# EAGLE design OMNIBUS Stepper board v2 (EAGLE 9.3.1)
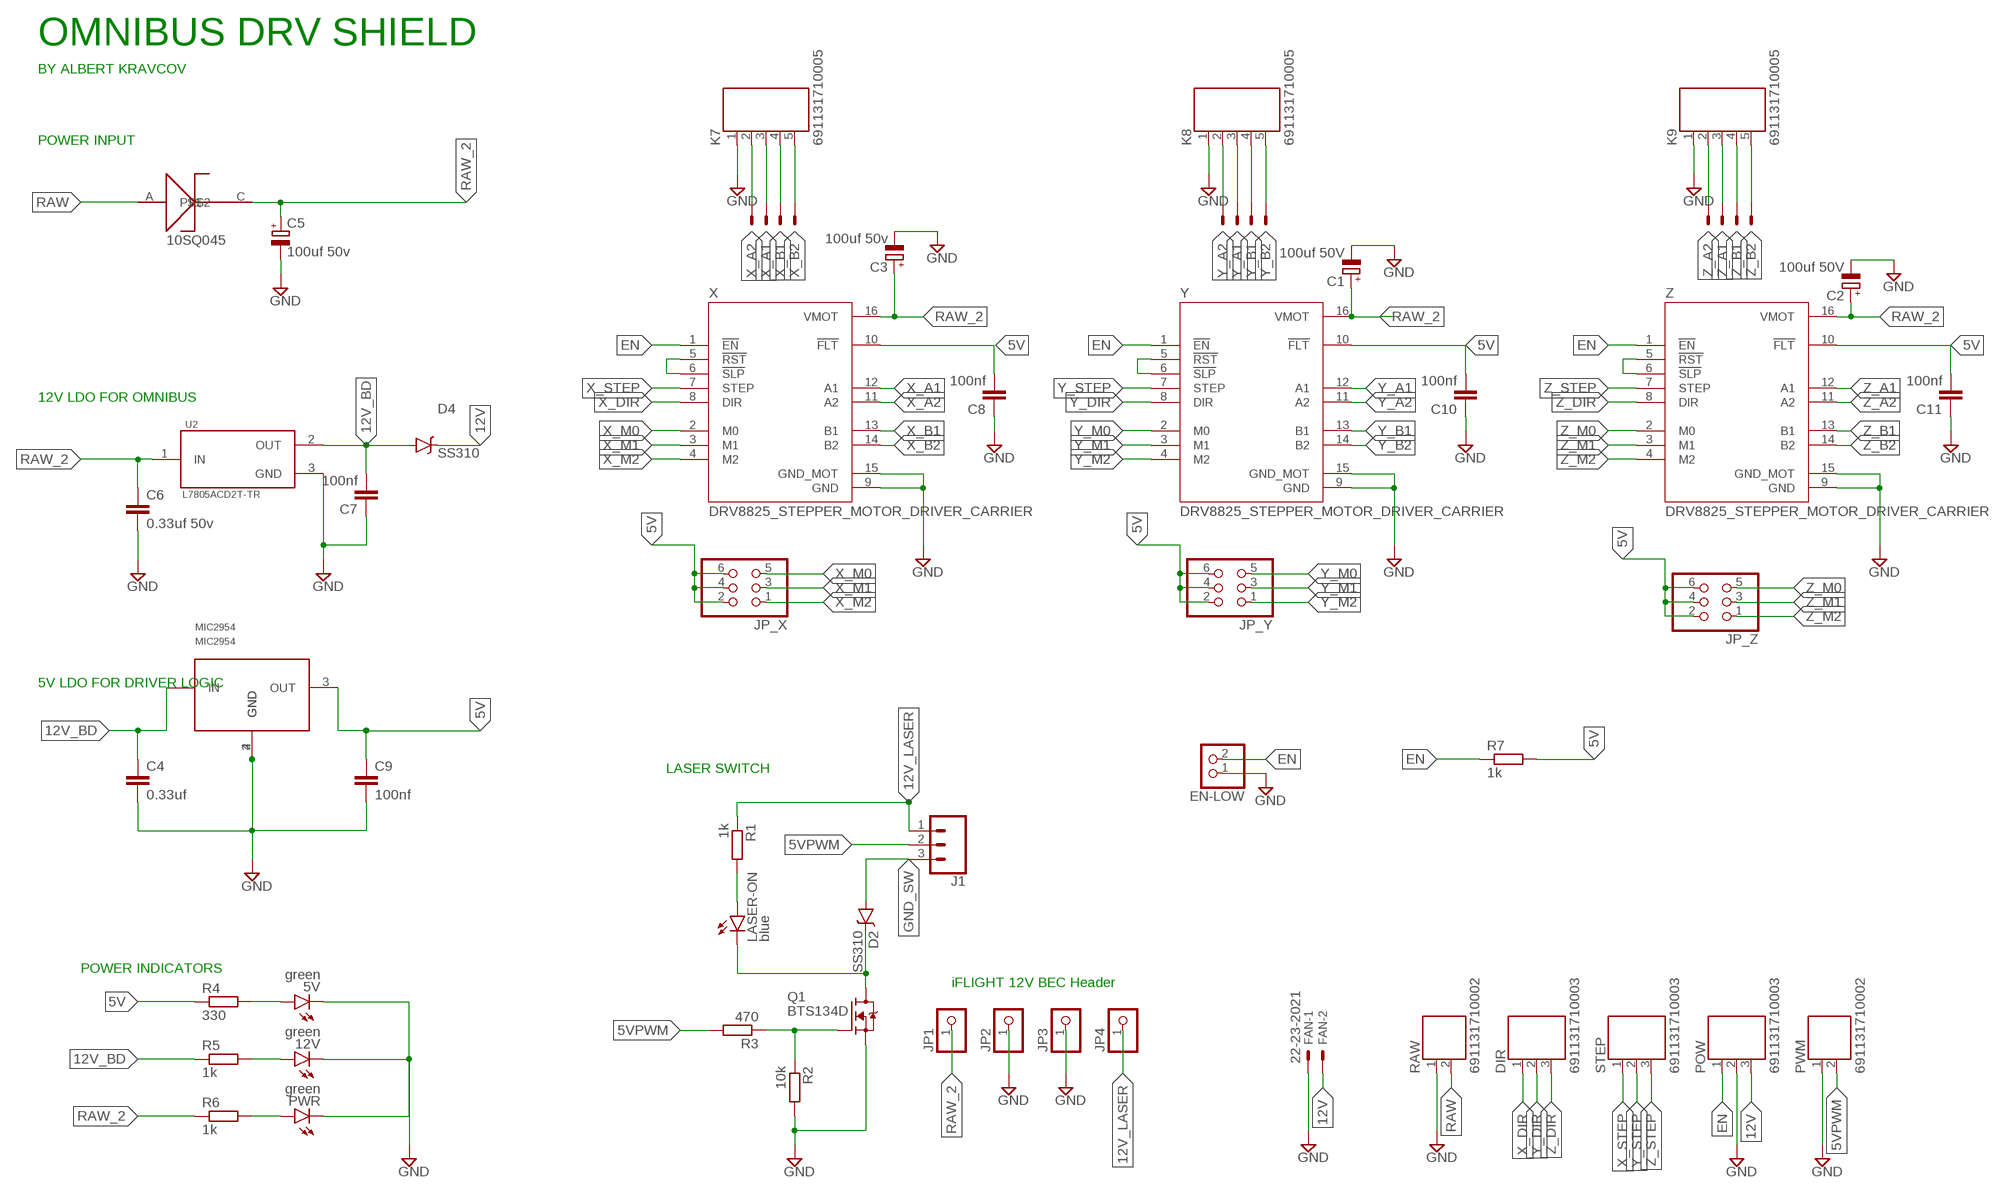
[diagram p0: schematic, sheet 1]

## Parts
5V  green  LEDCHIPLED_0805  [CHIPLED_0805]
12V  green  LEDCHIPLED_0805  [CHIPLED_0805]
C1  100uf 50V  CPOL-EUE5-6  [E5-6]
C2  100uf 50V  CPOL-EUE5-6  [E5-6]
C3  100uf 50v  CPOL-EUE5-6  [E5-6]
C4  0.33uf  C-EUC1206  [C1206]
C5  100uf 50v  CPOL-EUE5-8.5  [E5-8,5]
C6  0.33uf 50v  C-EUC1206  [C1206]
C7  100nf  C-EUC0805  [C0805]
C8  100nf  C-EUC0805  [C0805]
C9  100nf  C-EUC1206  [C1206]
C10  100nf  C-EUC0805  [C0805]
C11  100nf  C-EUC0805  [C0805]
D1  10SQ045  10SQ050  [DIOAD885W125L910D885]
D2  SS310  SS54  [DO-214AC]
D4  SS310  SS54  [DO-214AC]
DIR  691131710003  [691131710003]
EN-LOW  PINHD-1X2  [1X02]
FAN  22-23-2021  [22-23-2021]
J1  CONN_03  [1X03]
JP1  PINHD-1X1  [1X01]
JP2  PINHD-1X1  [1X01]
JP3  PINHD-1X1  [1X01]
JP4  PINHD-1X1  [1X01]
JP_X  PINHD-2X3  [2X03]
JP_Y  PINHD-2X3  [2X03]
JP_Z  PINHD-2X3  [2X03]
K7  691131710005  [691131710005]
K8  691131710005  [691131710005]
K9  691131710005  [691131710005]
LASER-ON  blue  LEDCHIPLED_0805  [CHIPLED_0805]
MIC2954  MIC2954  [SOT223]
POW  691131710003  [691131710003]
PWM  691131710002  [691131710002]
PWR  green  LEDCHIPLED_0805  [CHIPLED_0805]
Q1  BTS134D  FQD7N10LTM  [TO-252]
R1  1k  R-EU_R0805  [R0805]
R2  10k  R-EU_R0805  [R0805]
R3  470  R-EU_R0805  [R0805]
R4  330  R-EU_R0805  [R0805]
R5  1k  R-EU_R0805  [R0805]
R6  1k  R-EU_R1206  [R1206]
R7  1k  R-EU_R0805  [R0805]
RAW  691131710002  [691131710002]
STEP  691131710003  [691131710003]
U2  L7805ACD2T-TR  [TO254P1515X470-3N]
X  DRV8825_STEPPER_MOTOR_DRIVER_CARRIER  [IC_DRV8825_STEPPER_MOTOR_DRIVER_CARRIER]
X_MOTOR  22-23-2041  [22-23-2041]
Y  DRV8825_STEPPER_MOTOR_DRIVER_CARRIER  [IC_DRV8825_STEPPER_MOTOR_DRIVER_CARRIER]
Y_MOTOR  22-23-2041  [22-23-2041]
Z  DRV8825_STEPPER_MOTOR_DRIVER_CARRIER  [IC_DRV8825_STEPPER_MOTOR_DRIVER_CARRIER]
Z_MOTOR  22-23-2041  [22-23-2041]

## Nets
5V [power]: C8.2 C9.1 C10.2 C11.2 JP_X.2 JP_X.4 JP_X.6 JP_Y.2 JP_Y.4 JP_Y.6 JP_Z.2 JP_Z.4 JP_Z.6 MIC2954.3(OUT) R4.1 R7.2 X.10(!FLT) Y.10(!FLT) Z.10(!FLT)
5VPWM [power]: J1.2 PWM.2 R3.2
12V [ha]: D4.C FAN.2 POW.3
12V_BD [ha]: C4.1 C7.2 D4.A MIC2954.1(IN) R5.1 U2.2(OUT)
12V_LASER [ha]: J1.1 JP4.1 R1.1
EN: EN-LOW.2 POW.1 R7.1 X.1(!EN) Y.1(!EN) Z.1(!EN)
GND: 5V.C 12V.C C1.- C2.- C3.- C4.2 C5.- C6.2 C7.1 C8.1 C9.2 C10.1 C11.1 EN-LOW.1 FAN.1 JP2.1 JP3.1 K7.1 K8.1 K9.1 MIC2954.2(GND) MIC2954.4(GND) POW.2 PWM.1 PWR.C Q1.3(S) R2.2 RAW.1 U2.3(GND) X.9(GND) X.15(GND_MOT) Y.9(GND) Y.15(GND_MOT) Z.9(GND) Z.15(GND_MOT)
GND_SW [power]: D2.A J1.3
L_SW [power]: D2.C LASER-ON.C Q1.T(D)
N$1: Q1.1(G) R2.1 R3.1
N$2: 5V.A R4.2
N$3: LASER-ON.A R1.2
N$7: 12V.A R5.2
N$10: PWR.A R6.2
NC [power]: Z.5(!RST) Z.6(!SLP)
NC2 [power]: Y.5(!RST) Y.6(!SLP)
NC3 [power]: X.5(!RST) X.6(!SLP)
RAW [ha]: D1.A RAW.2
RAW_2 [ha]: C1.+ C2.+ C3.+ C5.+ C6.1 D1.C JP1.1 R6.1 U2.1(IN) X.16(VMOT) Y.16(VMOT) Z.16(VMOT)
X_A1 [ha]: K7.3 X.12(A1) X_MOTOR.3
X_A2 [ha]: K7.2 X.11(A2) X_MOTOR.4
X_B1 [ha]: K7.4 X.13(B1) X_MOTOR.2
X_B2 [ha]: K7.5 X.14(B2) X_MOTOR.1
X_DIR [power]: DIR.1 X.8(DIR)
X_M0: JP_X.5 X.2(M0)
X_M1: JP_X.3 X.3(M1)
X_M2: JP_X.1 X.4(M2)
X_STEP [power]: STEP.1 X.7(STEP)
Y_A1 [ha]: K8.3 Y.12(A1) Y_MOTOR.3
Y_A2 [ha]: K8.2 Y.11(A2) Y_MOTOR.4
Y_B1 [ha]: K8.4 Y.13(B1) Y_MOTOR.2
Y_B2 [ha]: K8.5 Y.14(B2) Y_MOTOR.1
Y_DIR [power]: DIR.2 Y.8(DIR)
Y_M0: JP_Y.5 Y.2(M0)
Y_M1: JP_Y.3 Y.3(M1)
Y_M2: JP_Y.1 Y.4(M2)
Y_STEP [power]: STEP.2 Y.7(STEP)
Z_A1 [ha]: K9.3 Z.12(A1) Z_MOTOR.3
Z_A2 [ha]: K9.2 Z.11(A2) Z_MOTOR.4
Z_B1 [ha]: K9.4 Z.13(B1) Z_MOTOR.2
Z_B2 [ha]: K9.5 Z.14(B2) Z_MOTOR.1
Z_DIR [power]: DIR.3 Z.8(DIR)
Z_M0: JP_Z.5 Z.2(M0)
Z_M1: JP_Z.3 Z.3(M1)
Z_M2: JP_Z.1 Z.4(M2)
Z_STEP [power]: STEP.3 Z.7(STEP)

## Notes on the sheet
- OMNIBUS DRV SHIELD
- BY ALBERT KRAVCOV
- POWER INPUT
- 10SQ045
- 12V LDO FOR OMNIBUS
- 5V LDO FOR DRIVER LOGIC
- LASER SWITCH
- POWER INDICATORS
- iFLIGHT 12V BEC Header

## Library data of the parts
5V 12V LASER-ON PWR = led:LED: LED OSRAM: - CHIPLED LG R971, LG N971, LY N971, LG Q971, LY Q971, LO R971, LY R971 LH N974, LH R974 LS Q976, LO Q976, LY Q976 LO Q996 - Hyper CHIPLED LW Q18S LB Q993, LB Q99A, LB R99A - SideLED LS A670, LO A670, LY A670, LG A670, LP A670 LB A673, LV A673, LT A673, LW A673 LH A674 LY A675 LS A676, LA A676, LO A676, LY A676, LW A676 LS A679, LY A679, LG A679 - Hyper Micro SIDELED® LS Y876, LA Y876, LO Y876, LY Y876 LT Y87S - SmartLED LW L88C, LW L88S LB L89C, LB L89S, LG L890 LS L89K, LO L89K, LY L89K LS L896, LA L896, LO L896, LY L896 - TOPLED LS T670, LO T670, LY T670, LG T670, LP T670 LSG T670, LSP T670, LSY T670, LOP T670, LYG T670 LG T671, LOG T671, LSG T671 LB T673, LV T673, LT T673, LW T673 LH T674 LS T676, LA T676, LO T676, LY T676, LB T676, LH T676, LSB T676, LW T676 LB T67C, LV T67C, LT T67C, LS T67K, LO T67K, LY T67K, LW E67C LS E67B, LA E67B, LO E67B, LY E67B, LB E67C, LV E67C, LT E67C LW T67C LS T679, LY T679, LG T679 LS T770, LO T770, LY T770, LG T770, LP T770 LB T773, LV T773, LT T773, LW T773 LH T774 LS E675, LA E675, LY E675, LS T675 LS T776, LA T776, LO T776, LY T776, LB T776 LHGB T686 LT T68C, LB T68C - Hyper Mini TOPLED® LB M676 - Mini TOPLED Santana® LG M470 LS M47K, LO M47K, LY M47K Source: http://www.osram.convergy.de LUXEON: - LUMILED® LXK2-PW12-R00, LXK2-PW12-S00, LXK2-PW14-U00, LXK2-PW14-V00 LXK2-PM12-R00, LXK2-PM12-S00, LXK2-PM14-U00 LXK2-PE12-Q00, LXK2-PE12-R00, LXK2-PE12-S00, LXK2-PE14-T00, LXK2-PE14-U00 LXK2-PB12-K00, LXK2-PB12-L00, LXK2-PB12-M00, LXK2-PB14-N00, LXK2-PB14-P00, LXK2-PB14-Q00 LXK2-PR12-L00, LXK2-PR12-M00, LXK2-PR14-Q00, LXK2-PR14-R00 LXK2-PD12-Q00, LXK2-PD12-R00, LXK2-PD12-S00 LXK2-PH12-R00, LXK2-PH12-S00 LXK2-PL12-P00, LXK2-PL12-Q00, LXK2-PL12-R00 Source: www.luxeon.com KINGBRIGHT: KA-3528ASYC Source: www.kingbright.com
C1-C3 C5 = rcl:CPOL-EU: POLARIZED CAPACITOR, European symbol; SPICEPREFIX: C
C4 C6-C11 = rcl:C-EU: CAPACITOR, European symbol; SPICEPREFIX: C
D1 = DIOAD885W125L910D885:10SQ050
D2 D4 = SS54:SS54: SCHOTTKY DIODES 40Vpeak, 28Vrms 5A (SBD) SMA(DO-214AC); AVAILABILITY: Unavailable; DESCRIPTION: Digital Switch Unipolar Switch Open Collector Hall Effect SOT-89B; MF: Honeywell Sensing; MP: SS54; PACKAGE: TO-243AA-243 Honeywell Sensing; PRICE: None
DIR POW STEP = Wurth_Terminal_Blocks_Connectors_rev15d:691131710003: WR-TBL Terminal block - CUU5/3 - 3 Pins;=>Code : Con_TBL_Screw_PClamp_5.00_6911317100xx_691131710003 <http://katalog.we-online.de/media/images/eican/Con_TBL_Screw_PClamp_5.00_6911317100xx_pf2.jpg> Details see: http://katalog.we-online.de/em/datasheet/6911317100xx.pdf Created 11/3/2014, Karrer Zheng 2014 (C) Wurth Elektronik
EN-LOW = pinhead:PINHD-1X2: PIN HEADER
FAN = con-molex:22-23-2021: .100" (2.54mm) Center Header - 2 Pin; MF: MOLEX; MPN: 22-23-2021; OC_FARNELL: 1462926; OC_NEWARK: 25C3832
J1 = SparkFun-Connectors:CONN_03: Multi connection point. Often used as Generic Header-pin footprint for 0.1 inch spaced/style header connections On any of the 0.1 inch spaced packages, you can populate with these: Break Away Headers - Straight <https://www.sparkfun.com/products/116> (PRT-00116) Break Away Male Headers - Right Angle <https://www.sparkfun.com/products/553> (PRT-00553) Female Headers <https://www.sparkfun.com/products/115> (PRT-00115) Break Away Headers - Machine Pin <https://www.sparkfun.com/products/117> (PRT-00117) Break Away Female Headers - Swiss Machine Pin <https://www.sparkfun.com/products/743> (PRT-00743) Stackable Header - 3 Pin (Female, 0.1") <https://www.sparkfun.com/products/13875> (PRT-13875) For SCREWTERMINALS and SPRING TERMINALS visit here: Screw Terimnals on SparkFun.com <https://www.sparkfun.com/search/results?term=Screw+Terminals> (5mm/3.5mm/2.54mm spacing) This device is also useful as a general connection point to wire up your design to another part of your project. Our various solder wires solder well into these plated through hole pads. Hook-Up Wire - Assortment (Stranded, 22 AWG) <https://www.sparkfun.com/products/11375> (PRT-11375) Hook-Up Wire - Assortment (Solid Core, 22 AWG) <https://www.sparkfun.com/products/11367> (PRT-11367) View the entire wire category on our website here <https://www.sparkfun.com/categories/141> Special notes: Molex polarized connector foot print use with SKU : PRT-08232 with associated crimp pins and housings.
JP1-JP4 = pinhead:PINHD-1X1: PIN HEADER
JP_X JP_Y JP_Z = pinhead:PINHD-2X3: PIN HEADER
K7-K9 = Wurth_Terminal_Blocks_Connectors_rev15d:691131710005: WR-TBL Terminal block - CUU5/5 - 5 Pins;=>Code : Con_TBL_Screw_PClamp_5.00_6911317100xx_691131710005 <http://katalog.we-online.de/media/images/eican/Con_TBL_Screw_PClamp_5.00_6911317100xx_pf2.jpg> Details see: http://katalog.we-online.de/em/datasheet/6911317100xx.pdf Created 11/3/2014, Karrer Zheng 2014 (C) Wurth Elektronik
MIC2954 = MIC2954:MIC2954: 5V 250mA regulator; AVAILABILITY: Unavailable; DESCRIPTION: Linear Voltage Regulator IC 1 Output 250mA 8-SOIC; MF: Micrel; MP: MIC2954; PACKAGE: SOT-223-3 Microchip; PRICE: None
PWM RAW = Wurth_Terminal_Blocks_Connectors_rev15d:691131710002: WR-TBL Terminal block - CUU5/2 CUU5/2GR - 2 Pins;=>Code : Con_TBL_Screw_PClamp_5.00_6911317100xx_691131710002 <http://katalog.we-online.de/media/images/eican/Con_TBL_Screw_PClamp_5.00_6911317100xx_pf2.jpg> Details see: http://katalog.we-online.de/em/datasheet/6911317100xx.pdf Created 11/23/2014, Karrer Zheng 2014 (C) Wurth Elektronik
Q1 = FQD7N10LTM:FQD7N10LTM: MOSFET N-CH 100V 5.8A 350mOhm 6nC DPAK Check prices <https://pricing.snapeda.com/parts/FQD7N10LTM/ON%20Semiconductor/view-part?ref=eda>; AVAILABILITY: Good; DESCRIPTION: N-Channel 100V 5.8A (Tc) 2.5W (Ta), 25W (Tc) Surface Mount D-Pak; MF: ON Semiconductor; MP: FQD7N10LTM; PACKAGE: TO-252-3 ON Semiconductor; PRICE: None; PURCHASE-URL: https://pricing.snapeda.com/search/part/FQD7N10LTM/?ref=eda
R1-R7 = rcl:R-EU_: RESISTOR, European symbol; SPICEPREFIX: R
U2 = L7805ACD2T-TR:L7805ACD2T-TR: Positive voltage regulator ICs Check prices <https://pricing.snapeda.com/parts/L7805ACD2T-TR/STMicroelectronics/view-part?ref=eda>; AVAILABILITY: Good; DESCRIPTION: Linear Voltage Regulator IC Positive Fixed 1 Output 1.5A D2PAK; MF: STMicroelectronics; MP: L7805ACD2T-TR; PACKAGE: D2PAK STMicroelectronics; PRICE: None; PURCHASE-URL: https://pricing.snapeda.com/search/part/L7805ACD2T-TR/?ref=eda
X Y Z = DRV8825_STEPPER_MOTOR_DRIVER_CARRIER:DRV8825_STEPPER_MOTOR_DRIVER_CARRIER: Stepper motor controler; IC: DRV8825; 1.5A; Uin mot: 8.2÷45V; AVAILABILITY: Unavailable; DESCRIPTION: Stepper, Bipolar 8.2 ~ 45VDC Supply 1.5A 8.2 ~ 45V Load; MF: Pololu; MP: DRV8825 STEPPER MOTOR DRIVER CARRIER; PACKAGE: None; PRICE: None
X_MOTOR Y_MOTOR Z_MOTOR = con-molex:22-23-2041: .100" (2.54mm) Center Header - 4 Pin; MF: MOLEX; MPN: 22-23-2041; OC_FARNELL: 1462920; OC_NEWARK: 38C0355

## Net classes
0 default: width 0.305 mm, drill 0.305 mm, clearance 0.305 mm
1 power: width 0.635 mm, drill 0.635 mm, clearance 0.635 mm
2 ha: width 1.524 mm, drill 0.762 mm, clearance 1.27 mm

## Board
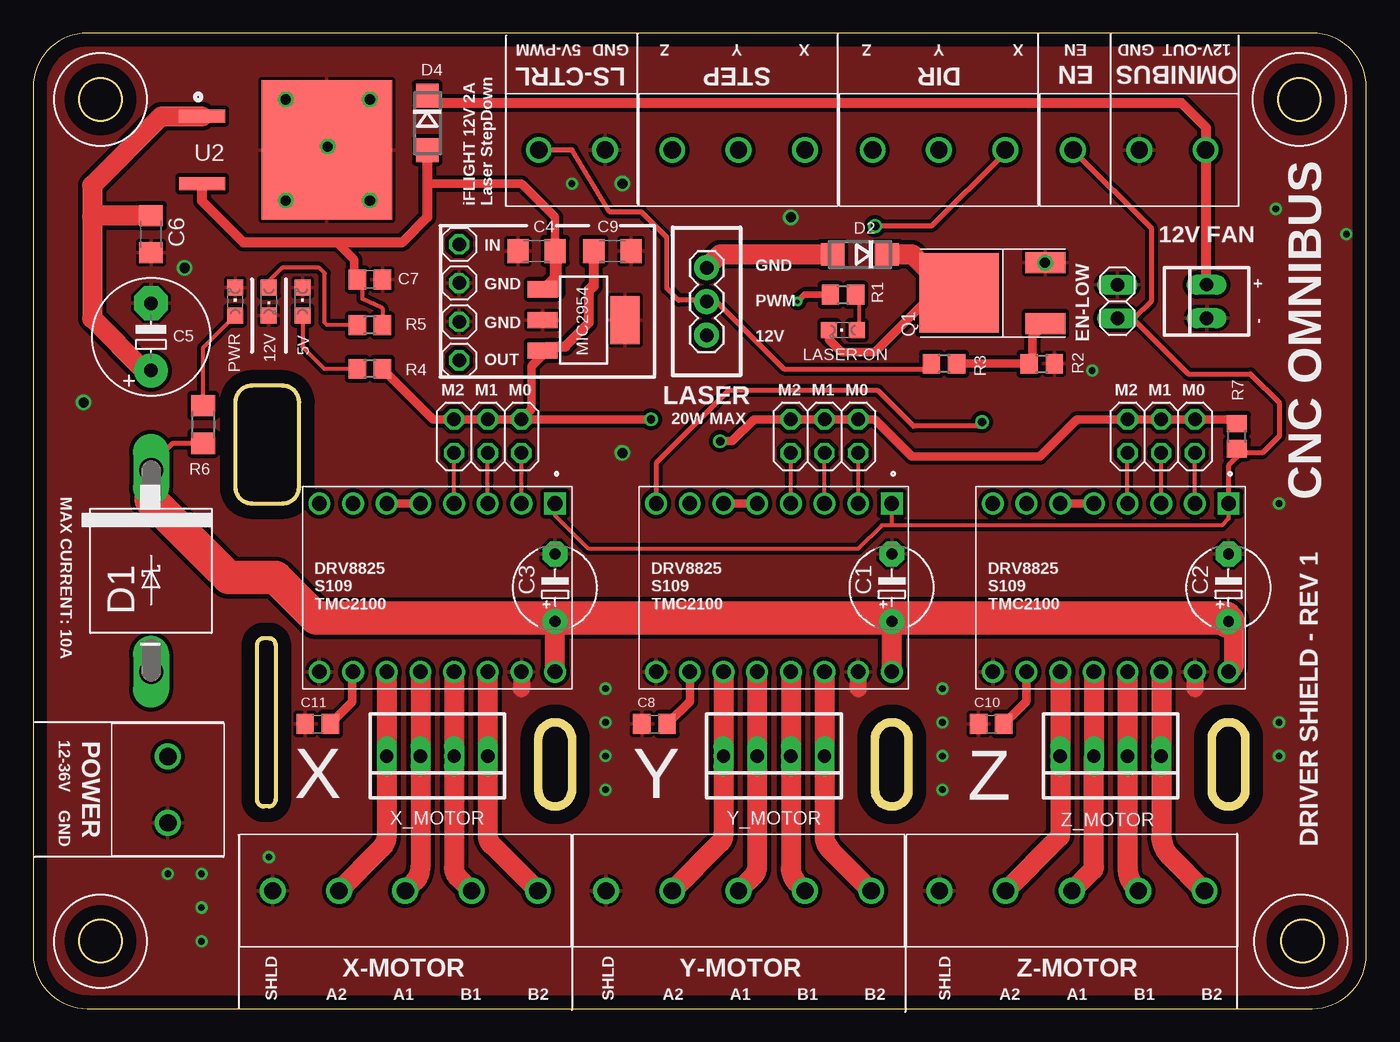
[diagram p1: board, top side]
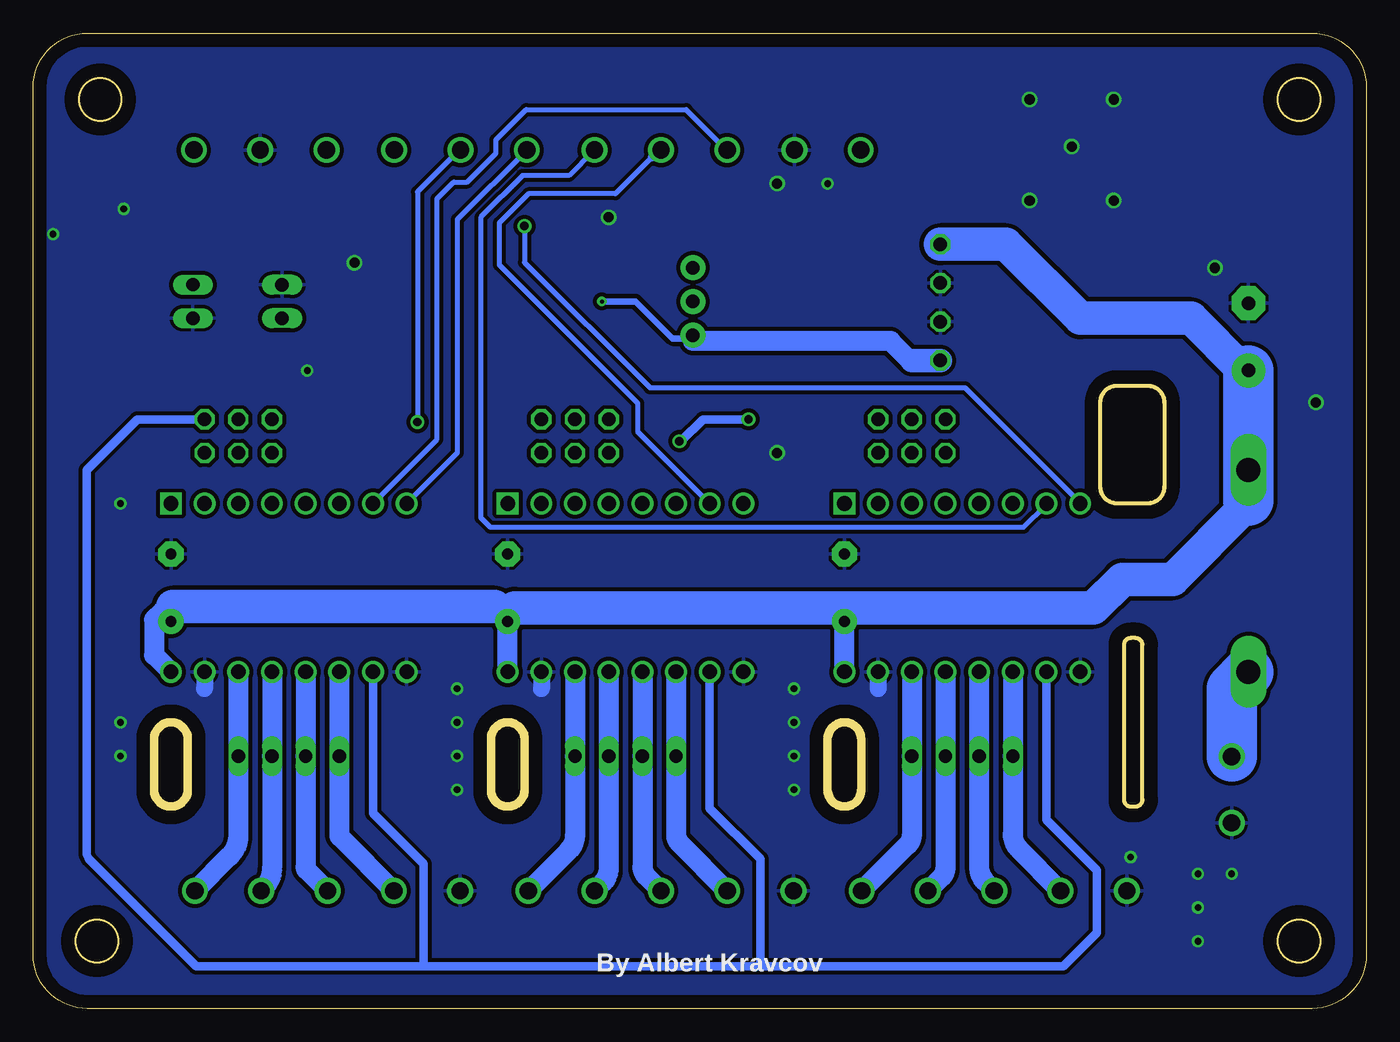
[diagram p2: board, bottom side, seen from below]

Size 100.56 x 73.58 mm. Coordinates in mm from the lower left corner, seen from the top.
Outline: 0,69.52 0,4.06 arc90 4.06,0 96.5,0 arc90 100.56,4.06 100.56,69.52 arc90 96.5,73.58 4.06,73.58 arc90 0,69.52
Outline: 15.24,45.72 15.24,39.37 arc90 16.51,38.1 18.8,38.1 arc90 20.07,39.37 20.07,45.72 arc90 18.8,46.99 16.51,46.99 arc90 15.24,45.72
Outline: 39.37,15.24 arc-90 38.1,16.51 38.1,20.32 arc-90 39.37,21.59 arc-90 40.64,20.32 40.64,16.51 arc-90 39.37,15.24
Outline: 64.77,15.24 arc-90 63.5,16.51 63.5,20.32 arc-90 64.77,21.59 arc-90 66.04,20.32 66.04,16.51 arc-90 64.77,15.24
Outline: 88.9,16.51 88.9,20.32 arc-90 90.17,21.59 arc-90 91.44,20.32 91.44,16.51 arc-90 90.17,15.24 arc-90 88.9,16.51
Outline: 17.78,15.24 17.4,15.24 arc-90 16.89,15.75 16.89,27.43 arc-90 17.4,27.94 17.78,27.94 arc-90 18.29,27.43 18.29,15.75 arc-90 17.78,15.24
Outline: circle at 5.08,5.08 radius 1.6
Outline: circle at 95.76,5.08 radius 1.6
Outline: circle at 5.08,68.58 radius 1.6
Outline: circle at 95.5,68.58 radius 1.6
Copper layers (1*16): Top 0.035mm / dielectric 1.5mm / Bottom 0.035mm
Design rules "default *": minimum track width 6mil, minimum drill 0.35mm, track to track 6mil, track to pad 6mil, pad to pad 6mil, via to via 6mil, smd to smd 6mil, copper to edge 40mil, drill to drill 6mil, minimum pad ring 10mil, minimum via ring 8mil, stop-mask expansion 4mil, vias tented up to drill 2mm, thermal gap 10mil

### Footprints (pad centres in the part's own frame; a part is rotated, then mirrored left to right if it is on the bottom)
CHIPLED_0805 = smd 1.2 x 1.2: A 0,-1.05; C 0,1.05
E5-6 = drill 0.813 pad 1.905: + -2.54,0 | drill 0.813 pad 1.905 octagon: - 2.54,0
C1206 = smd 1.6 x 1.8: 1 -1.4,0; 2 1.4,0
E5-8,5 = drill 1.016 pad 2.54: + -2.54,0 | drill 1.016 pad 2.54 octagon: - 2.54,0
C0805 = smd 1.3 x 1.5: 1 -0.95,0; 2 0.95,0
DIOAD885W125L910D885 = drill 1.803 long: A 7.62,0; C -7.62,0
DO-214AC = smd 1.8 x 1.7: A 2.05,0; C -2.05,0
691131710003 = drill 1.3: 1 -5,0; 2 0,0; 3 5,0
1X02 = drill 1.016 long: 1 -1.27,0; 2 1.27,0
22-23-2021 = drill 1 long: 1 -1.27,0; 2 1.27,0
1X03 = drill 1.016 pad 1.88: 1 0,0; 2 2.54,0; 3 5.08,0
1X01 = drill 1.016 octagon: 1 0,0
2X03 = drill 1.016 octagon: 1 -2.54,-1.27; 2 -2.54,1.27; 3 0,-1.27; 4 0,1.27; 5 2.54,-1.27; 6 2.54,1.27
691131710005 = drill 1.3: 1 -10,0; 2 -5,0; 3 0,0; 4 5,0; 5 10,0
SOT223 = smd 1.219 x 2.235: 1 -2.311,-3.099; 2 0,-3.099; 3 2.311,-3.099 | smd 3.6 x 2.2: 4 0,3.099
691131710002 = drill 1.3: 1 -2.5,0; 2 2.5,0
TO-252 = smd 1.6 x 3: 1 -2.3,-6.5; 3 2.3,-6.5 | smd 6 x 6: T 0,0
R0805 = smd 1.3 x 1.5: 1 -0.95,0; 2 0.95,0
R1206 = smd 1.6 x 1.803: 1 -1.422,0; 2 1.422,0
TO254P1515X470-3N = smd 3.45 x 1: 1 -6.3,2.54; 2 -6.3,-2.54 | smd 9.85 x 10.5: 3 3.1,0
IC_DRV8825_STEPPER_MOTOR_DRIVER_CARRIER = drill 1.1 square: 1 -6.35,8.89 | drill 1.1: 2 -6.35,6.35; 3 -6.35,3.81; 4 -6.35,1.27; 5 -6.35,-1.27; 6 -6.35,-3.81; 7 -6.35,-6.35; 8 -6.35,-8.89; 9 6.35,-8.89; 10 6.35,-6.35; 11 6.35,-3.81; 12 6.35,-1.27; 13 6.35,1.27; 14 6.35,3.81; 15 6.35,6.35; 16 6.35,8.89
22-23-2041 = drill 1 long: 1 -3.81,0; 2 -1.27,0; 3 1.27,0; 4 3.81,0

### Placement (x,y rotation side)
5V  20.32,53.34 0 top
12V  17.78,53.34 180 top
C1  64.77,31.75 90 top
C2  90.17,31.75 90 top
C3  39.37,31.75 90 top
C4  37.97,57.15 180 top
C5  8.89,50.67 90 top
C6  8.89,58.42 270 top
C7  25.4,54.99 180 top
C8  46.86,21.46 0 top
C9  43.69,57.15 0 top
C10  72.26,21.46 0 top
C11  21.46,21.46 0 top
D1  8.89,33.02 270 top
D2  62.36,56.9 180 top
D4  29.72,66.8 270 top
DIR  68.33,64.77 180 top
EN-LOW  81.79,53.34 270 top
FAN  88.52,53.34 90 top
J1  50.8,50.8 90 top
JP1  32.13,57.66 0 top
JP2  32.13,54.74 0 top
JP3  32.13,51.82 0 top
JP4  32.13,48.9 0 top
JP_X  34.29,43.18 0 top
JP_Y  59.69,43.18 0 top
JP_Z  85.09,43.18 0 top
K7  28.07,8.89 0 top
K8  53.21,8.89 0 top
K9  78.36,8.89 0 top
LASER-ON  61.09,51.18 90 top
MIC2954  41.53,51.94 270 top
POW  83.44,64.77 0 top
PWM  40.64,64.77 180 top
PWR  15.24,53.34 0 top
Q1  69.85,53.98 90 top
R1  61.09,53.85 0 top
R2  76.07,48.64 0 top
R3  68.71,48.64 180 top
R4  25.4,48.26 180 top
R5  25.4,51.56 180 top
R6  12.83,44.07 90 top
R7  90.81,43.18 90 top
RAW  10.16,16.51 90 top
STEP  53.21,64.77 180 top
U2  19.05,64.77 0 top
X  30.48,31.75 270 top
X_MOTOR  30.48,19.05 180 top
Y  55.88,31.75 270 top
Y_MOTOR  55.88,19.05 180 top
Z  81.28,31.75 270 top
Z_MOTOR  81.28,19.05 180 top

### Tracks (layer width: path | path; a pad name or v marks a point on that pad's centre or on a via)
5V  (via drill 0.64)
  Top 0.635: JP_X.6 JP_X.4 JP_X.2 30.16,44.45 R4.1 | 38.38,49.25 37.59,48.46 37.59,45.21 JP_X.6 | R7.2 90.48,44.45 JP_Z.6 JP_Z.4 JP_Z.2 78.74,44.45 75.95,41.66 66.29,41.66 63.5,44.45 JP_Y.6 JP_Y.4 JP_Y.2 54.36,44.45 52.7,42.8 v51.82,42.8 | JP_X.6 v46.61,44.45 | C11.2 24.06,23.11 24.06,25.33 X.10 | C8.2 49.53,23.18 Y.10 | C10.2 74.93,23.18 Z.10
  Top 0.762: 38.38,49.25 38.38,49.58 MIC2954.3 38.73,49.94 40.13,49.94 41.91,51.72 41.91,54.23 42.29,54.61 | C9.1 42.29,54.61 | 42.29,54.61 42.29,54.48 42.17,54.36
  Bottom 0.635: 45.72,3.17 22.86,3.17 20.32,5.71 20.32,10.41 24.13,14.22 X.10 | 45.72,3.17 71.12,3.17 | 71.12,3.17 88.27,3.17 96.37,11.28 96.52,11.64 96.52,40.64 92.71,44.45 JP_Z.6 | 71.12,3.17 71.12,10.92 74.93,14.73 Z.10 | 45.72,3.17 45.72,11.29 49.53,15.1 Y.10 | v51.82,42.8 51.69,42.8 50.04,44.45 v46.61,44.45
5VPWM
  Top 0.305: 51.56,53.34 J1.2 50.7,53.44
  Top 0.381: R3.2 67.38,48.26 56.64,48.26 51.56,53.34 | 50.7,53.44 48.69,53.44 47.8,54.33 47.8,58.17 45.87,60.1 43.49,60.1 40.66,64.77 PWM.2
  Bottom 0.305: PWM.2 38.1,64.77
12V
  Top 0.762: FAN.2 88.44,54.69 POW.3 88.44,66.5 86.61,68.33 30.24,68.33 D4.C
12V_BD
  Top 0.305: 24.2,55.25 C7.2 24.83,54.61 24.83,53.54 26.35,52.83 R5.1
  Top 0.635: 24.2,55.25 24.2,56.52 22.93,57.79 | 39.55,54 39.55,57.09 C4.1 39.37,59.69 36.83,62.23 29.72,62.23
  Top 0.762: D4.A 29.72,62.23 29.72,59.69 27.81,57.79 22.93,57.79 15.88,57.79 12.75,60.91 U2.2 | MIC2954.1 39.37,55.2 C4.1
12V_LASER  (via drill 0.3)
  Top 0.508: R1.1 58.17,53.85 v57.66,53.34
  Bottom 0.508: v57.66,53.34 55.12,53.34 52.32,50.55 51.05,50.55 J1.1
  Bottom 1.524: J1.1 50.8,50.37 35.89,50.37 34.42,48.9 34.29,48.9
  Bottom 1.778: JP4.1 34.29,48.9
EN
  Top 0.305: Z.1 90.17,36.96 89.66,36.45 64.77,36.45 | 64.77,36.45 Y.1 | X.1 39.37,37.21 41.91,34.67 62.23,34.67 64.01,36.45 64.77,36.45
  Top 0.381: 91.28,42.07 90.17,40.96 Z.1 | POW.1 84.33,58.88 84.33,53.34 83.06,52.07 EN-LOW.2 82.93,52.07 87.12,47.88 91.82,47.88 93.98,45.72 93.98,43.18 92.71,41.91 91.12,41.91 R7.1
  Top 0.635: 91.28,42.07 90.97,42.07 R7.1
GND  (via drill 0.51, 0.76)
  Top 1.27: X.15 36.83,24.13 | Y.15 62.23,24.13 | Z.15 87.63,24.13
  Bottom 1.27: X.15 36.83,24.13 | Y.15 62.23,24.13 | Z.15 87.63,24.13
  other vias: 43.18,24.13 43.18,21.59 43.18,19.05 17.78,11.43 10.16,10.16 12.7,10.16 12.7,7.62 12.7,5.08 43.18,16.51 68.58,24.13 68.58,21.59 68.58,19.05 68.58,16.51 93.98,21.59 93.98,19.05 57.15,59.69 44.45,41.91 40.64,62.23 44.45,62.23 93.73,60.33 99.06,58.42 79.88,48.13 93.98,38.1 22.22,65.02 11.43,55.88 3.81,45.72 19.05,68.58 19.05,60.96 25.4,60.96 25.4,68.58 76.33,56.26
  pour Top: -1.27,73.66 -1.27,-0.86 arc45 -0.08,-3.73 0,-3.81 101.6,-3.81 101.6,69.44 arc45 100.41,72.31 99.06,73.66
  pour Bottom: -3.81,77.47 -3.81,-5.08 101.19,-5.08 arc-45 104.06,-6.27 104.14,-6.35 104.14,71.98 arc45 102.95,74.85 100.33,77.47
GND_SW
  Top 1.524: J1.3 51.82,56.9 D2.A
L_SW
  Top 0.635: Q1.T 69.09,53.21 68.58,53.21 67.18,53.21 63.5,49.53 60.96,49.53 60.04,50.45 LASER-ON.C
  Top 1.524: D2.C 66.29,56.9 68.58,54.61 68.58,53.21
N$1
  Top 0.305: R3.1 72.39,48.64
  Top 0.635: R3.1 R2.1 75.38,48.9 75.38,50.7 Q1.1
N$2
  Top 0.305: 5V.A 20.32,49.91 21.97,48.26 R4.2
N$3
  Top 0.305: 62.29,53.59 62.29,51.34
  Top 0.635: R1.2 62.29,53.59 | LASER-ON.A 62.29,51.34
N$7
  Top 0.305: R5.2 22.16,51.56 22,51.72 22,55.47 21.59,55.88 18.8,55.88 17.78,54.86 12V.A
N$10
  Top 0.305: R6.2 12.83,49.88 PWR.A
NC
  Top 0.635: Z.5 Z.6
NC2
  Top 0.635: Y.5 Y.6
NC3
  Top 0.635: X.5 X.6
RAW
  Bottom 3.81: RAW.2 10.16,24.13 D1.A
RAW_2
  Top 0.381: 8.89,41 10.54,42.65 R6.1
  Top 1.524: Y.16 C1.+ | 90.55,29.08 90.55,25.78 Z.16 | 90.23,29.4 C2.+ | 4.45,59.72 4.45,62.08 9.68,67.31 U2.1 | C5.+ 8.38,48.13 4.45,52.07 4.45,59.72 | D1.C 8.89,41 | C6.1 5.4,59.82 4.45,59.72 | X.16 C3.+
  Top 1.778: 90.55,29.08 90.23,29.4
  Top 2.54: D1.C 8.89,38.35 14.73,32.51 18.29,32.51 21.34,29.46 39.33,29.46 C3.+ | 39.5,29.46 64.73,29.46 C1.+ 65.02,29.46 89.92,29.46 C2.+
  Bottom 1.524: X.16 C3.+ | C1.+ 64.26,30.23 | Y.16 C1.+ | Z.16 91.44,26.67 91.44,29.34 90.81,29.97 C2.+ | C2.+ 90.04,30.1 | 65.75,30.32 65.41,29.97 C1.+ | 90.06,30.32 C2.+
  Bottom 2.54: 64.26,30.23 20.57,30.23 18.41,32.38 14.61,32.38 9.04,37.95 arc-45 8.89,38.31 | 65.75,30.32 90.06,30.32 | C5.+ 9.27,48.13 13.21,52.07 21.59,52.07 27.18,57.66 JP1.1
  Bottom 3.81: 8.89,38.31 D1.C C5.+
X_A1
  Top 1.524: K7.3 28.75,9.57 arc45 29.21,10.69 X_MOTOR.3 X.12
  Bottom 1.524: X.12 X_MOTOR.3 29.21,10.69 arc-45 28.75,9.57 K7.3
X_A2
  Top 1.524: K7.2 26.21,12.03 arc45 26.67,13.15 X_MOTOR.4 X.11
  Bottom 1.524: X.11 X_MOTOR.4 26.67,13.15 arc-45 26.21,12.03 K7.2
X_B1
  Top 1.524: K7.4 32.03,9.92 arc-45 31.75,10.61 X_MOTOR.2 X.13
  Bottom 1.524: X.13 X_MOTOR.2 31.75,10.61 arc45 32.03,9.92 K7.4
X_B2
  Top 1.524: K7.5 34.57,12.38 arc-45 34.29,13.07 X_MOTOR.1 X.14
  Bottom 1.524: X.14 X_MOTOR.1 34.29,13.07 arc45 34.57,12.38 K7.5
X_DIR  (via drill 0.64)
  Top 0.381: v63.5,59.03 67.77,59.03 73.17,64.43
  Top 0.635: 73.17,64.43 DIR.1
  Bottom 0.381: 21.59,38.15 30.28,46.84 54.05,46.84 63.5,56.29 v63.5,59.03
  Bottom 0.635: 21.59,38.15 X.8
X_M0
  Top 0.305: X.2 JP_X.5
X_M1
  Top 0.305: X.3 JP_X.3
X_M2
  Top 0.305: X.4 JP_X.1
X_STEP
  Bottom 0.381: 24.18,38 25.86,36.32 66.09,36.32 66.8,37.03 66.8,59.69 63.65,62.84 60.15,62.84 58.32,64.67 | STEP.1
  Bottom 0.635: 24.18,38 X.7 | 58.32,64.67 STEP.1
Y_A1
  Top 1.524: Y.12 Y_MOTOR.3 54.61,10.69 arc-45 54.33,10 K8.3
  Bottom 1.524: Y.12 Y_MOTOR.3 54.61,10.69 arc-45 54.33,10 K8.3
Y_A2
  Top 1.524: Y.11 Y_MOTOR.4 52.07,13.15 arc-45 51.79,12.46 K8.2
  Bottom 1.524: Y.11 Y_MOTOR.4 52.07,13.15 arc-45 51.79,12.46 K8.2
Y_B1
  Top 1.524: Y.13 Y_MOTOR.2 57.15,10.61 arc45 57.61,9.49 K8.4
  Bottom 1.524: Y.13 Y_MOTOR.2 57.15,10.61 arc45 57.61,9.49 K8.4
Y_B2
  Top 1.524: Y.14 Y_MOTOR.1 59.69,13.07 arc45 60.15,11.95 K8.5
  Bottom 1.524: Y.14 Y_MOTOR.1 59.69,13.07 arc45 60.15,11.95 K8.5
Y_DIR  (via drill 0.64)
  Top 0.381: Y.8 46.99,41.15 52.45,46.61 63.73,46.61 66.4,43.94 71.27,43.94 v71.58,44.25
  Bottom 0.381: v71.58,44.25 71.58,61.62 68.73,64.47
  Bottom 0.635: 68.73,64.47 DIR.2
Y_M0
  Top 0.305: JP_Y.5 Y.2
Y_M1
  Top 0.305: Y.3 JP_Y.3
Y_M2
  Top 0.305: Y.4 JP_Y.1
Y_STEP
  Bottom 0.381: STEP.2 53.72,64.26 | Y.7 54.97,43.54 54.97,45.67 65.41,56.11 65.41,59.26 63.2,61.47 56.64,61.47 53.9,64.21
  Bottom 0.635: 53.9,64.21 STEP.2
Z_A1
  Top 1.524: K9.3 79.91,10.44 arc45 80.01,10.69 Z_MOTOR.3 Z.12
  Bottom 1.524: Z.12 Z_MOTOR.3 80.01,10.69 arc-45 79.91,10.44 K9.3
Z_A2
  Top 1.524: K9.2 77.37,12.9 arc45 77.47,13.15 Z_MOTOR.4 Z.11
  Bottom 1.524: Z.11 Z_MOTOR.4 77.47,13.15 arc-45 77.37,12.9 K9.2
Z_B1
  Top 1.524: K9.4 83.19,9.06 arc-45 82.55,10.61 Z_MOTOR.2 Z.13
  Bottom 1.524: Z.13 Z_MOTOR.2 82.55,10.61 arc45 83.19,9.06 K9.4
Z_B2
  Top 1.524: K9.5 85.73,11.52 arc-45 85.09,13.07 Z_MOTOR.1 Z.14
  Bottom 1.524: Z.14 Z_MOTOR.1 85.09,13.07 arc45 85.73,11.52 K9.5
Z_DIR
  Bottom 0.381: DIR.3 68.58,59.52 68.58,41.91 Z.8
Z_M0
  Top 0.305: Z.2 JP_Z.5
Z_M1
  Top 0.305: Z.3 JP_Z.3
Z_M2
  Top 0.305: Z.4 JP_Z.1
Z_STEP
  Bottom 0.381: Z.7 70.1,42.93 70.1,61.09 68.83,62.36 67.82,62.36 65.66,64.52 65.66,65.53 63.37,67.82 51.31,67.82 48.26,64.77 STEP.3

### Text on the board
tNames: 5V-PWM | GND | Z | Y | X | Z | Y | X | EN | GND | 12V-OUT | LS-CTRL | STEP | DIR | EN | OMNIBUS | iFLIGHT 12V 2A / Laser StepDown | 12V FAN | IN | GND | GND | + | PWM | GND | - | CNC OMNIBUS | 12V | OUT | M2 | M1 | M0 | M2 | M1 | M0 | M2 | M1 | M0 | LASER | 20W MAX | MAX CURRENT: 10A | DRV8825 / S109 / TMC2100 | DRV8825 / S109 / TMC2100 | DRV8825 / S109 / TMC2100 | DRIVER SHIELD - REV 1 | 12-36V | POWER | GND | SHLD | X-MOTOR | SHLD | Y-MOTOR | SHLD | Z-MOTOR | A2 | A1 | B1 | B2 | A2 | A1 | B1 | B2 | A2 | A1 | B1 | B2
bNames: By Albert Kravcov